# Altium schematic sheet DRV8301_2.SchDoc
size A3
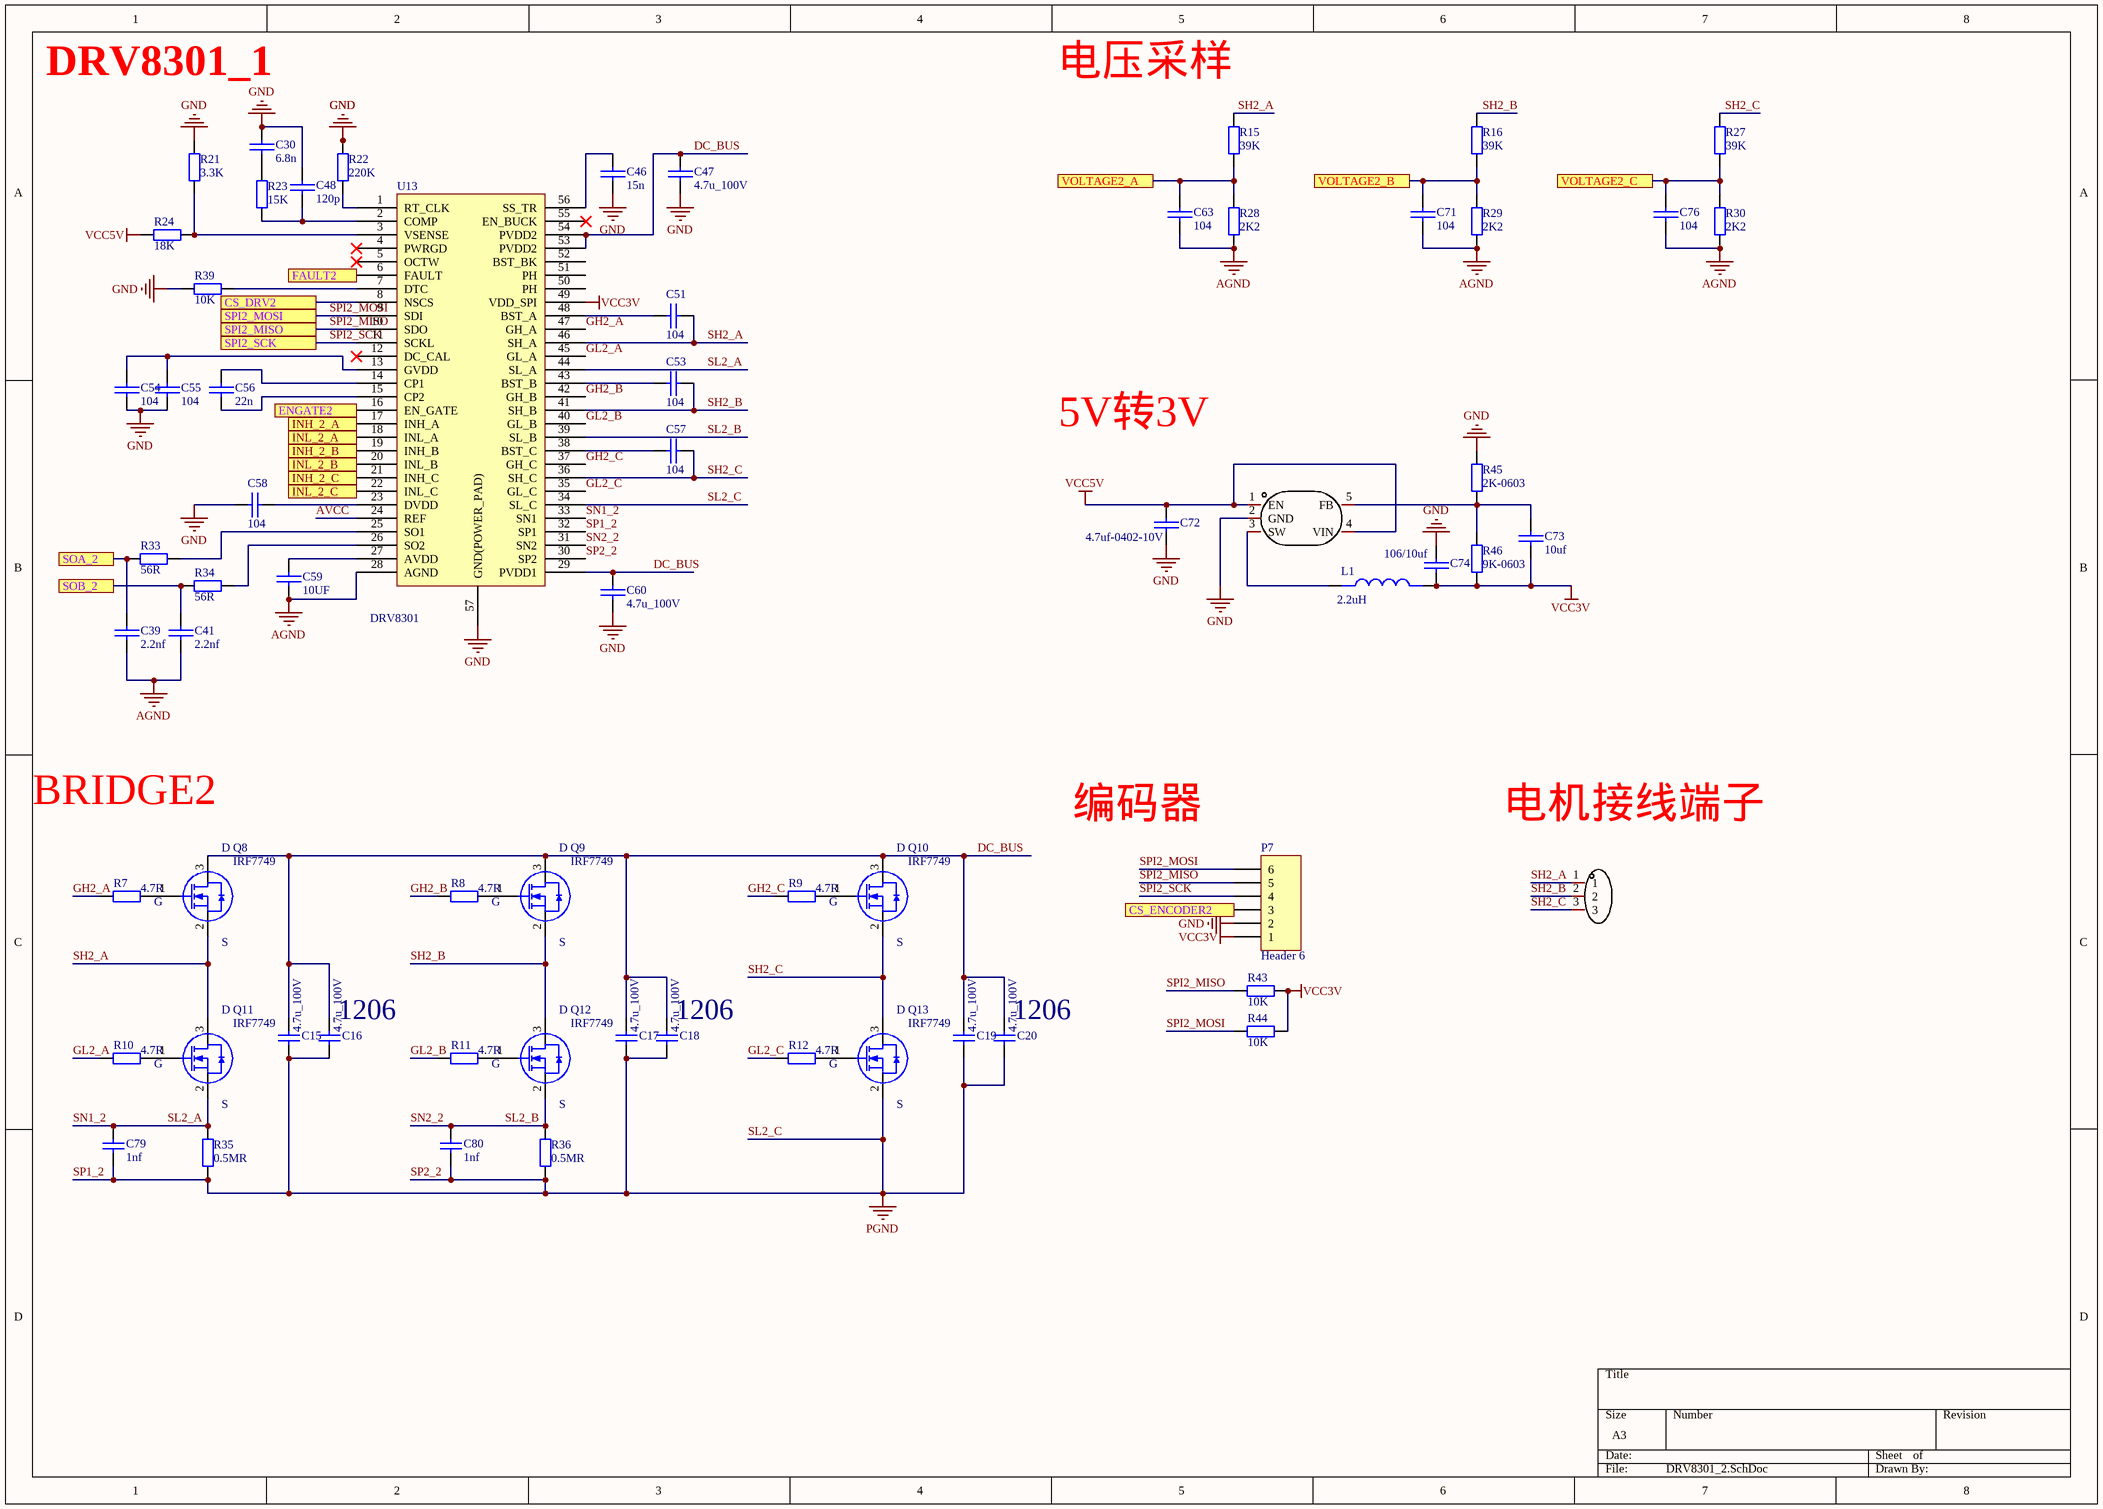
[diagram p0: DRV8301_2.SchDoc]

## Parts
C15  value 4.7u_100V  [1206_C]  (hidden comment: Cap)
C16  value 4.7u_100V  [1206_C]  (hidden comment: Cap)
C17  value 4.7u_100V  [1206_C]  (hidden comment: Cap)
C18  value 4.7u_100V  [1206_C]  (hidden comment: Cap)
C19  value 4.7u_100V  [1206_C]  (hidden comment: Cap)
C20  value 4.7u_100V  [1206_C]  (hidden comment: Cap)
C30  value 6.8n  [0402C]  (hidden comment: CAP)
C39  value 2.2nf  [0402C]  (hidden comment: CAP)
C41  value 2.2nf  [0402C]  (hidden comment: CAP)
C46  value 15n  [0402C]  (hidden comment: CAP)
C47  value 4.7u_100V  [0603_C]  (hidden comment: CAP)
C48  value 120p  [0402C]  (hidden comment: CAP)
C51  value 104  [0402C]  (hidden comment: CAP)
C53  value 104  [0402C]  (hidden comment: CAP)
C54  value 104  [0402C]  (hidden comment: CAP)
C55  value 104  [0402C]  (hidden comment: CAP)
C56  value 22n  [0402C]  (hidden comment: CAP)
C57  value 104  [0402C]  (hidden comment: CAP)
C58  value 104  [0402C]  (hidden comment: CAP)
C59  value 10UF  [0402C]  (hidden comment: CAP)
C60  value 4.7u_100V  [0603_C]  (hidden comment: CAP)
C63  value 104  [0402C]  (hidden comment: CAP)
C71  value 104  [0402C]  (hidden comment: CAP)
C72  value 4.7uf-0402-10V  [0402C]  (hidden comment: CAP)
C73  value 10uf  [0402C]  (hidden comment: CAP)
C74  value 106/10uf  [0402C]  (hidden comment: CAP)
C76  value 104  [0402C]  (hidden comment: CAP)
C79  value 1nf  [0402C]  (hidden comment: Cap)
C80  value 1nf  [0402C]  (hidden comment: Cap)
L1  2.2uH  [IND-SMD_L4.4-W4.2]
P7  Header 6  [A1002WR-S-6P]
Q8  IRF7749  [IRF7480]
Q9  IRF7749  [IRF7480]
Q10  IRF7749  [IRF7480]
Q11  IRF7749  [IRF7480]
Q12  IRF7749  [IRF7480]
Q13  IRF7749  [IRF7480]
R7  value 4.7R  [0402R]  (hidden comment: Res1)
R8  value 4.7R  [0402R]  (hidden comment: Res1)
R9  value 4.7R  [0402R]  (hidden comment: Res1)
R10  value 4.7R  [0402R]  (hidden comment: Res1)
R11  value 4.7R  [0402R]  (hidden comment: Res1)
R12  value 4.7R  [0402R]  (hidden comment: Res1)
R15  39K  [0402R]
R16  39K  [0402R]
R21  3.3K  [0402R]
R22  220K  [0402R]
R23  15K  [0402R]
R24  18K  [0402R]
R27  39K  [0402R]
R28  2K2  [0402R]
R29  2K2  [0402R]
R30  2K2  [0402R]
R33  56R  [0402R]
R34  56R  [0402R]
R35  value 0.5MR  [0.5mr_6W]  (hidden comment: Res1)
R36  value 0.5MR  [0.5mr_6W]  (hidden comment: Res1)
R39  10K  [0402R]
R43  10K  [0402R]
R44  10K  [0402R]
R45  2K-0603  [0603_R]
R46  9K-0603  [0603_R]
U8  MR30-M  [MR30-M-SMD]  (value not drawn)
U11  TLV62569DBVR  [SOT-23-5_L3.0-W1.7-P0.95-LS2.8-BR]  (value not drawn)
U13  DRV8301  [HTSSOP-56_L14.0-W6.0-P0.50-LS8.0-BL]

## Ports
CS_DRV2, CS_ENCODER2, ENGATE2, FAULT2, INH_2_A, INH_2_B, INH_2_C, INL_2_A, INL_2_B, INL_2_C, SOA_2, SOB_2, SPI2_MISO, SPI2_MOSI, SPI2_SCK, VOLTAGE2_A, VOLTAGE2_B, VOLTAGE2_C

## Nets
AGND: C39.1 C41.1 C59.1 C63.2 C71.2 C76.2 R28.2 R29.2 R30.2 U13.28(AGND)
GND: C30.2 C46.1 C47.1 C48.2 C54.1 C55.1 C58.1 C60.1 C72.2 C74.1 P7.2 R21.2 R22.2 R39.1 R45.1 U11.2(GND) U13.57(GND(POWER_PAD))
SL2_C: C15.1 C16.1 C17.1 C18.1 C19.1 C20.1 C79.1 C80.1 Q13.2(S) R35.1 R36.1 U13.30(SP2) U13.32(SP1) U13.34(SL_C)  [also labelled PGND, SP1_2, SP2_2]
VCC3V: C73.2 C74.2 L1.2(Pri-) P7.1 R43.2 R44.2 R46.2 U13.49(VDD_SPI)
VCC5V: C72.1 R24.1 U11.1(EN) U11.4(VIN)
AVCC: U13.24(REF)
CS_DRV2: U13.8(NSCS) ; port CS_DRV2
CS_ENCODER2: P7.3 ; port CS_ENCODER2
DC_BUS: C15.2 C16.2 C17.2 C18.2 C19.2 C20.2 C47.2 C60.2 Q8.3(D) Q9.3(D) Q10.3(D) U13.29(PVDD1) U13.53(PVDD2) U13.54(PVDD2)
ENGATE2: U13.16(EN_GATE) ; port ENGATE2
FAULT2: U13.6(FAULT) ; port FAULT2
GH2_A: R7.1 U13.47(GH_A)
GH2_B: R8.1 U13.42(GH_B)
GH2_C: R9.1 U13.37(GH_C)
GL2_A: R10.1 U13.45(GL_A)
GL2_B: R11.1 U13.40(GL_B)
GL2_C: R12.1 U13.35(GL_C)
INH_2_A: U13.17(INH_A) ; port INH_2_A
INH_2_B: U13.19(INH_B) ; port INH_2_B
INH_2_C: U13.21(INH_C) ; port INH_2_C
INL_2_A: U13.18(INL_A) ; port INL_2_A
INL_2_B: U13.20(INL_B) ; port INL_2_B
INL_2_C: U13.22(INL_C) ; port INL_2_C
SH2_A: C51.1 Q8.2(S) Q11.3(D) R15.2 U8.1 U13.46(SH_A)
SH2_B: C53.1 Q9.2(S) Q12.3(D) R16.2 U8.2 U13.41(SH_B)
SH2_C: C57.1 Q10.2(S) Q13.3(D) R27.2 U8.3 U13.36(SH_C)
SL2_A: C79.2 Q11.2(S) R35.2 U13.33(SN1) U13.44(SL_A)  [also labelled SN1_2]
SL2_B: C80.2 Q12.2(S) R36.2 U13.31(SN2) U13.39(SL_B)  [also labelled SN2_2]
SOA_2: C39.2 R33.1 ; port SOA_2
SOB_2: C41.2 R34.1 ; port SOB_2
SPI2_MISO: P7.5 R43.1 U13.10(SDO) ; port SPI2_MISO
SPI2_MOSI: P7.6 R44.1 U13.9(SDI) ; port SPI2_MOSI
SPI2_SCK: P7.4 U13.11(SCKL) ; port SPI2_SCK
VOLTAGE2_A: C63.1 R15.1 R28.1 ; port VOLTAGE2_A
VOLTAGE2_B: C71.1 R16.1 R29.1 ; port VOLTAGE2_B
VOLTAGE2_C: C76.1 R27.1 R30.1 ; port VOLTAGE2_C
NetC30_1: C30.1 R23.2
NetC46_2: C46.2 U13.56(SS_TR)
NetC48_1: C48.1 R23.1 U13.2(COMP)
NetC51_2: C51.2 U13.48(BST_A)
NetC53_2: C53.2 U13.43(BST_B)
NetC54_2: C54.2 C55.2 U13.13(GVDD)
NetC56_1: C56.1 U13.14(CP1)
NetC56_2: C56.2 U13.15(CP2)
NetC57_2: C57.2 U13.38(BST_C)
NetC58_2: C58.2 U13.23(DVDD)
NetC59_2: C59.2 U13.27(AVDD)
NetC73_1: C73.1 R45.2 R46.1 U11.5(FB)
NetL1_1: L1.1(Pri-) U11.3(SW)
NetQ8_1: Q8.1(G) R7.2
NetQ9_1: Q9.1(G) R8.2
NetQ10_1: Q10.1(G) R9.2
NetQ11_1: Q11.1(G) R10.2
NetQ12_1: Q12.1(G) R11.2
NetQ13_1: Q13.1(G) R12.2
NetR21_1: R21.1 R24.2 U13.3(VSENSE)
NetR22_1: R22.1 U13.1(RT_CLK)
NetR33_2: R33.2 U13.25(SO1)
NetR34_2: R34.2 U13.26(SO2)
NetR39_2: R39.2 U13.7(DTC)

Not connected (* = marked no-connect by the designer): U13 4(PWRGD)* 5(OCTW)* 12(DC_CAL)* 50(PH) 51(PH) 52(BST_BK) 55(EN_BUCK)*

## Notes on the sheet
- DRV8301_1
- 电压采样
- 5V转3V
- BRIDGE2
- 编码器
- 电机接线端子
- (near C16) 1206
- (near C18) 1206
- (near C20) 1206

## Library data of the parts
C15-C20 C79 C80 = Cap_6: 无极性电容; Published: 8-Jun-2000; LatestRevisionDate: 17-Jul-2002; LatestRevisionNote: Re-released for DXP Platform.; PackageReference: RAD-0.3; Publisher: Altium Limited
L1 = IND
P7 = Header 6: Header, 6-Pin; LatestRevisionDate: 17-Jul-2002; LatestRevisionNote: Re-released for DXP Platform.; Publisher: Altium Limited
Q8-Q13 = IRF7749: MOS(场效应管)
R7-R12 R35 R36 = Res1: 贴片电阻; Published: 8-Jun-2000; LatestRevisionDate: 17-Jul-2002; LatestRevisionNote: Re-released for DXP Platform.; PackageReference: AXIAL-0.4; Publisher: Altium Limited
R15 R16 R21-R24 R27-R30 R33 R34 R45 R46 = Res2: Resistor; Value: 10K; Published: 8-Jun-2000; LatestRevisionDate: 17-Jul-2002; LatestRevisionNote: Re-released for DXP Platform.; PackageReference: AXIAL-0.4; Publisher: Altium Limited; PackageDescription: Axial Device, Thru-Hole; 2 Leads; 0.4 in Pin Spacing
R39 R43 R44 = Res2: Resistor; Published: 8-Jun-2000; LatestRevisionDate: 17-Jul-2002; LatestRevisionNote: Re-released for DXP Platform.; PackageReference: AXIAL-0.4; Publisher: Altium Limited; PackageDescription: Axial Device, Thru-Hole; 2 Leads; 0.4 in Pin Spacing; Value: 10K
U8 = MR30-M: Manufacturer: AMASS(艾迈斯); Add into BOM: yes; Name: MR30-M; Symbol: MR30-M; Device: MR30-M; LCSC Part Name: MR30-M 两件套; Supplier Part: C99873; Manufacturer Part: MR30-M; Supplier Footprint: -; JLCPCB Part Class: Extended Part; Datasheet: https://atta.szlcsc.com/upload/public/pdf/source/20170412/1491969315720.pdf; Supplier: LCSC; Convert to PCB: yes
U11 = TLV62569DBVR: Manufacturer: TI(德州仪器); Add into BOM: yes; Function: 降压型; Synchronous Rectification: 是; Output Type: 可调; Topology: 降压式; Input Voltage: 2.5V~5.5V; Output Voltage: 600mV~5.5V; Output Current (Max): 2A; Switching Frequency: 1.5MHz; Name: TLV62569DBVR; Symbol: TLV62569DBVR; Device: TLV62569DBVR; LCSC Part Name: 降压型 输入2.5V~5.5V 输出600mV~5.5V 2A; Supplier Part: C141836; Manufacturer Part: TLV62569DBVR; Supplier Footprint: SOT-23-5; JLCPCB Part Class: Extended Part; Datasheet: https://atta.szlcsc.com/upload/public/pdf/source/20180423/C141836_1FC17A3D2C2E4ECD339DF92B83CED618.pdf; Supplier: LCSC; Convert to PCB: yes; Number of Outputs: -; Operating Temperature: -40℃~+125℃@(TJ)
U13 = DRV8301: 三相整流桥芯片